# EAGLE design tohuart (EAGLE 7.2.0)
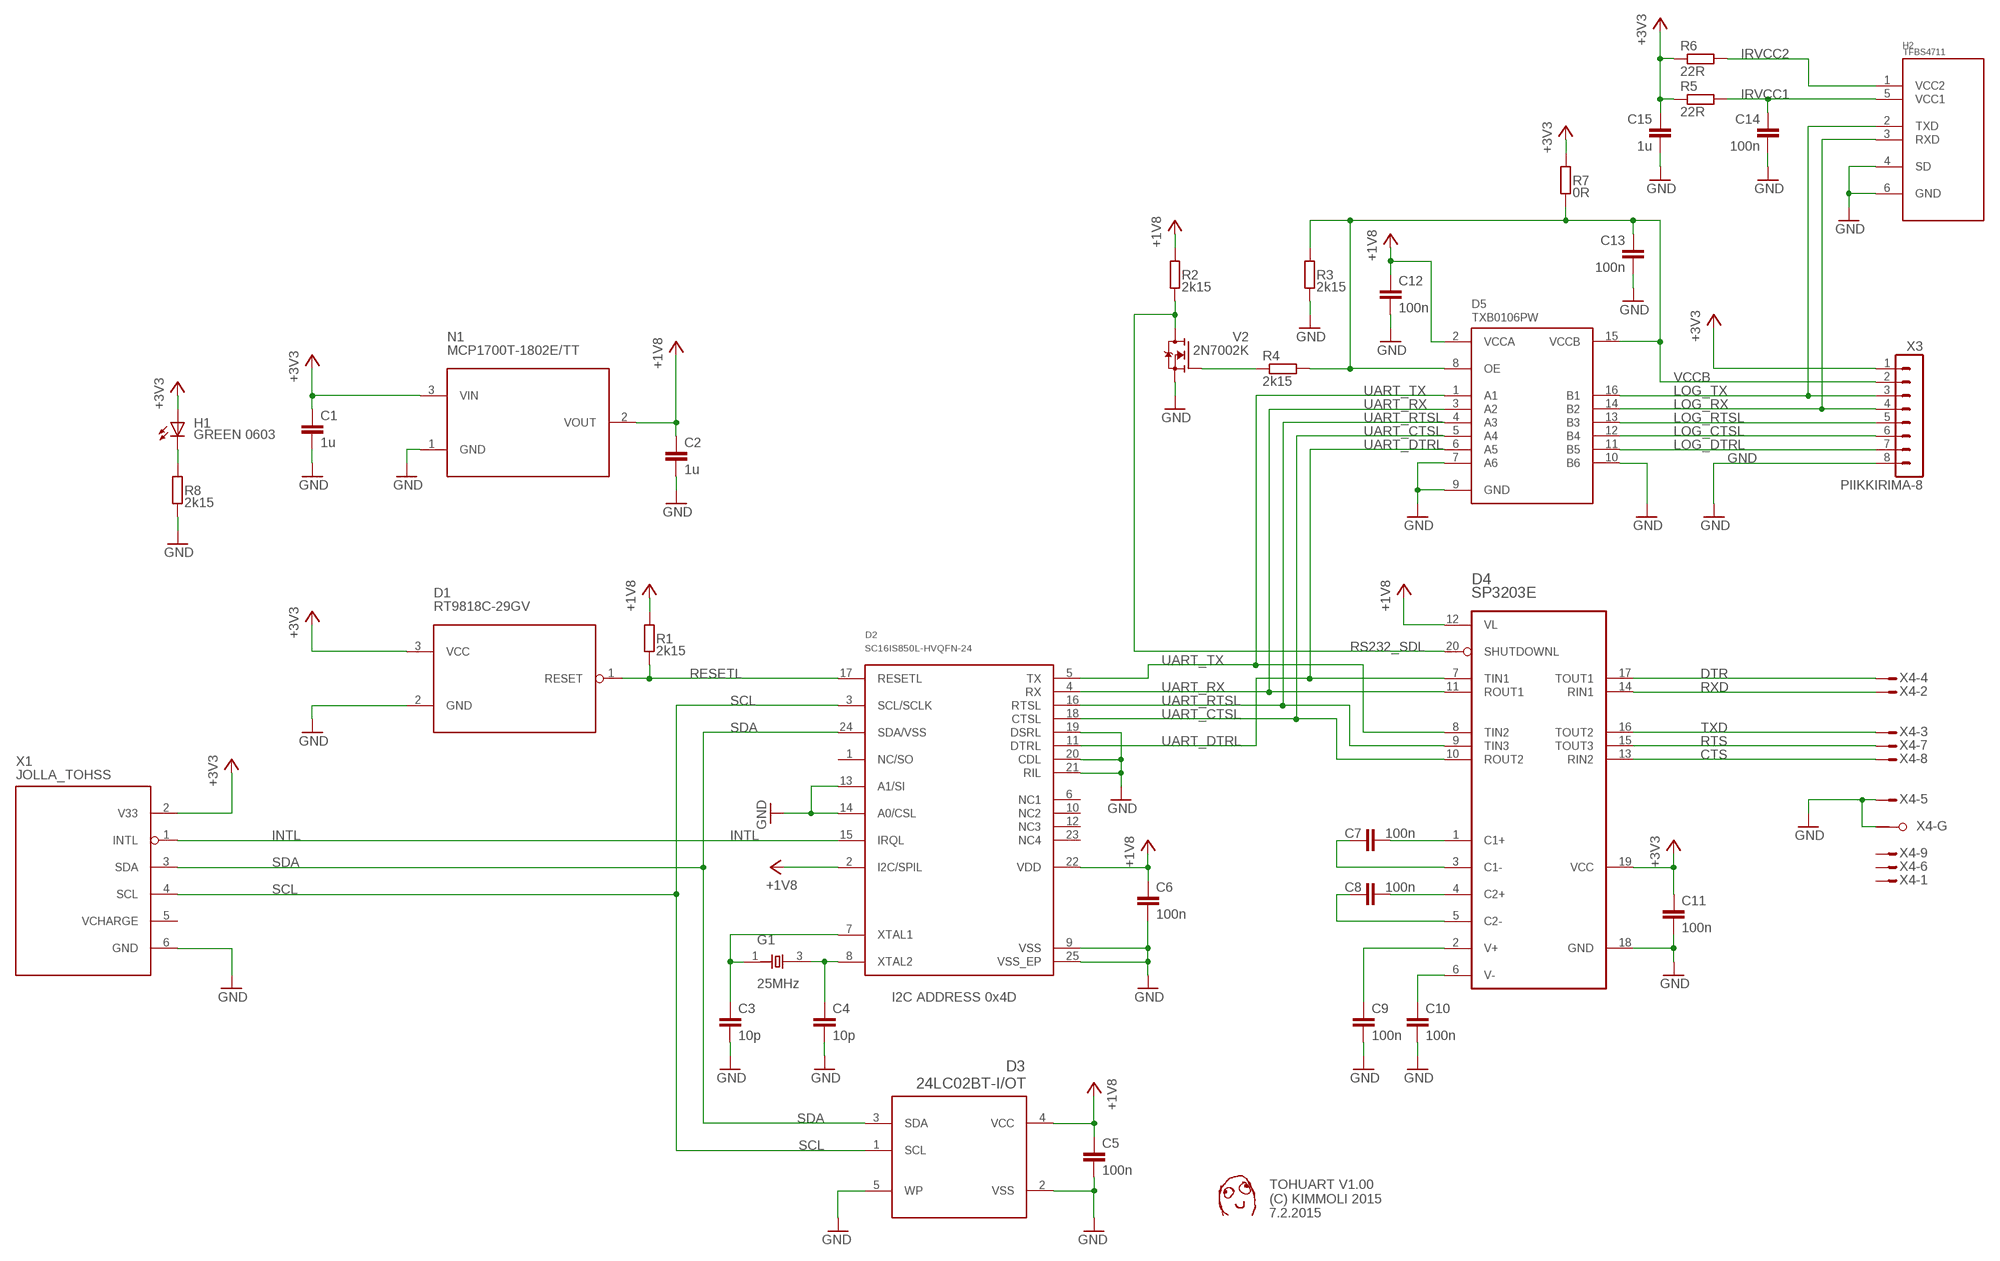
[diagram p0: schematic, sheet 1]

## Parts
C1  1u  C-EUC0603  [C0603]
C2  1u  C-EUC0603  [C0603]
C3  10p  C-EUC0603  [C0603]
C4  10p  C-EUC0603  [C0603]
C5  100n  C-EUC0603  [C0603]
C6  100n  C-EUC0603  [C0603]
C7  100n  C-EUC0603  [C0603]
C8  100n  C-EUC0603  [C0603]
C9  100n  C-EUC0603  [C0603]
C10  100n  C-EUC0603  [C0603]
C11  100n  C-EUC0603  [C0603]
C12  100n  C-EUC0603  [C0603]
C13  100n  C-EUC0603  [C0603]
C14  100n  C-EUC0603  [C0603]
C15  1u  C-EUC0603  [C0603]
D1  RT9818C-29GV  [SOT23]
D2  SC16IS850L-HVQFN-24  [HVQFN-24]
D3  24LC02BT-I/OT  [SOT95P280X145-5N]
D4  SP3203E  [TSSOP-20]
D5  TXB0106PW  [TSSOP-16-065]
G1  25MHz  XTAL_3225_SMD  [X_3225]
H1  GREEN 0603  LEDCHIP-LED0603  [CHIP-LED0603]
H2  TFBS4711  [TFBS4711]
N1  MCP1700T-1802E/TT  [SOT23]
R1  2k15  R-EU_R0603  [R0603]
R2  2k15  R-EU_R0603  [R0603]
R3  2k15  R-EU_R0603  [R0603]
R4  2k15  R-EU_R0603  [R0603]
R5  22R  R-EU_R0603  [R0603]
R6  22R  R-EU_R0603  [R0603]
R7  0R  R-EU_R0603  [R0603]
R8  2k15  R-EU_R0603  [R0603]
U$1  DAFUG  [DAFUG]
V2  2N7002K  [SOT23]
X1  JOLLA_TOHSS  [JOLLA_TOH_POGOPADS]
X3  PIIKKIRIMA-8  [PIIKKIRIMA-8]
X4  M09VPS  [M09VP]

## Nets
+1V8: C2.1 C5.1 C6.1 C12.1 D2.2(I2C/SPIL) D2.22(VDD) D3.4(VCC) D4.12(VL) D5.2(VCCA) N1.2(VOUT) R1.2 R2.2
+3V3: C1.1 C11.1 C15.1 D1.3(VCC) D4.19(VCC) H1.A N1.3(VIN) R5.1 R6.1 R7.2 X1.2(V33) X3.1
CTS: D4.13(RIN2) X4.8(-8:M)
DTR: D4.17(TOUT1) X4.4(-4:M)
GND: C1.2 C2.2 C3.2 C4.2 C5.2 C6.2 C9.2 C10.2 C11.2 C12.2 C13.2 C14.2 C15.2 D1.2(GND) D2.9(VSS) D2.13(A1/SI) D2.14(A0/CSL) D2.19(DSRL) D2.20(CDL) D2.21(RIL) D2.25(VSS_EP) D3.2(VSS) D3.5(WP) D4.18(GND) D5.7(A6) D5.9(GND) D5.10(B6) H2.4(SD) H2.6(GND) N1.1(GND) R3.1 R8.1 V2.2(S) X1.6(GND) X3.8 X4.5(-5:M) X4.G1(-G:G1)
INTL: D2.15(IRQL) X1.1(INTL)
IRVCC1: C14.1 H2.5(VCC1) R5.2
IRVCC2: H2.1(VCC2) R6.2
LOG_CTSL: D5.12(B4) X3.6
LOG_DTRL: D5.11(B5) X3.7
LOG_RTSL: D5.13(B3) X3.5
LOG_RX: D5.14(B2) H2.3(RXD) X3.4
LOG_TX: D5.16(B1) H2.2(TXD) X3.3
N$1: R4.1 V2.1(G)
N$2: H1.C R8.2
N$4: C10.1 D4.6(V-)
N$5: C9.1 D4.2(V+)
N$6: C8.1 D4.5(C2-)
N$7: C8.2 D4.4(C2+)
N$8: C7.1 D4.3(C1-)
N$9: C7.2 D4.1(C1+)
N$14: C4.1 D2.8(XTAL2) G1.3(X2)
N$15: C3.1 D2.7(XTAL1) G1.1(X1)
RESETL: D1.1(RESET) D2.17(RESETL) R1.1
RS232_SDL: D4.20(SHUTDOWNL) R2.1 V2.3(D)
RTS: D4.15(TOUT3) X4.7(-7:M)
RXD: D4.14(RIN1) X4.2(-2:M)
SCL: D2.3(SCL/SCLK) D3.1(SCL) X1.4(SCL)
SDA: D2.24(SDA/VSS) D3.3(SDA) X1.3(SDA)
TXD: D4.16(TOUT2) X4.3(-3:M)
UART_CTSL: D2.18(CTSL) D4.10(ROUT2) D5.5(A4)
UART_DTRL: D2.11(DTRL) D4.7(TIN1) D5.6(A5)
UART_RTSL: D2.16(RTSL) D4.9(TIN3) D5.4(A3)
UART_RX: D2.4(RX) D4.11(ROUT1) D5.3(A2)
UART_TX: D2.5(TX) D4.8(TIN2) D5.1(A1)
VCCB: C13.1 D5.8(OE) D5.15(VCCB) R3.2 R4.2 R7.1 X3.2
Unconnected: D2.1(NC/SO) D2.6(NC1) D2.10(NC2) D2.12(NC3) D2.23(NC4) X1.5(VCHARGE) X4.1(-1:M) X4.6(-6:M) X4.9(-9:M) X4.G2(-G:G2)

## Notes on the sheet
- I2C ADDRESS 0x4D
- TOHUART V1.00
  (C) KIMMOLI 2015
  7.2.2015

## Library data of the parts
C1-C15 = rcl:C-EU: CAPACITOR, European symbol
D1 = OMAT_IC:RT9818C-29GV
D2 = OMAT_IC:SC16IS850L-HVQFN-24
D3 = OMAT_IC:24LC02BT-I/OT: Serial EEPROM; MPN: 24LC02BT-I/OT; OC_FARNELL: 9757910; OC_NEWARK: 89C9800; PACKAGE: SOT23-5; SUPPLIER: MICROCHIP
D4 = OMAT_IC:SP3203E
D5 = OMAT_IC:TXB0106PW
G1 = OMAT_IC:XTAL_3225_SMD: CRYSTAL CLOCK OSCILLATORS 5.0 Vdc or 3.3 Vdc - LOW PROFILE ULTRA MINIATURE CERAMIC SURFACE MOUNT Source: http://www.abracon.com/Oscillators/asf1-L-L1.pdf
H1 = OMAT_IC:LED: LED OSRAM: - CHIPLED LG R971, LG N971, LY N971, LG Q971, LY Q971, LO R971, LY R971 LH N974, LH R974 LS Q976, LO Q976, LY Q976 LO Q996 - Hyper CHIPLED LW Q18S LB Q993, LB Q99A, LB R99A - SideLED LS A670, LO A670, LY A670, LG A670, LP A670 LB A673, LV A673, LT A673, LW A673 LH A674 LY A675 LS A676, LA A676, LO A676, LY A676, LW A676 LS A679, LY A679, LG A679 - Hyper Micro SIDELED® LS Y876, LA Y876, LO Y876, LY Y876 LT Y87S - SmartLED LW L88C, LW L88S LB L89C, LB L89S, LG L890 LS L89K, LO L89K, LY L89K LS L896, LA L896, LO L896, LY L896 - TOPLED LS T670, LO T670, LY T670, LG T670, LP T670 LSG T670, LSP T670, LSY T670, LOP T670, LYG T670 LG T671, LOG T671, LSG T671 LB T673, LV T673, LT T673, LW T673 LH T674 LS T676, LA T676, LO T676, LY T676, LB T676, LH T676, LSB T676, LW T676 LB T67C, LV T67C, LT T67C, LS T67K, LO T67K, LY T67K, LW E67C LS E67B, LA E67B, LO E67B, LY E67B, LB E67C, LV E67C, LT E67C LW T67C LS T679, LY T679, LG T679 LS T770, LO T770, LY T770, LG T770, LP T770 LB T773, LV T773, LT T773, LW T773 LH T774 LS E675, LA E675, LY E675, LS T675 LS T776, LA T776, LO T776, LY T776, LB T776 LHGB T686 LT T68C, LB T68C - Hyper Mini TOPLED® LB M676 - Mini TOPLED Santana® LG M470 LS M47K, LO M47K, LY M47K Source: http://www.osram.convergy.de LUXEON: - LUMILED® LXK2-PW12-R00, LXK2-PW12-S00, LXK2-PW14-U00, LXK2-PW14-V00 LXK2-PM12-R00, LXK2-PM12-S00, LXK2-PM14-U00 LXK2-PE12-Q00, LXK2-PE12-R00, LXK2-PE12-S00, LXK2-PE14-T00, LXK2-PE14-U00 LXK2-PB12-K00, LXK2-PB12-L00, LXK2-PB12-M00, LXK2-PB14-N00, LXK2-PB14-P00, LXK2-PB14-Q00 LXK2-PR12-L00, LXK2-PR12-M00, LXK2-PR14-Q00, LXK2-PR14-R00 LXK2-PD12-Q00, LXK2-PD12-R00, LXK2-PD12-S00 LXK2-PH12-R00, LXK2-PH12-S00 LXK2-PL12-P00, LXK2-PL12-Q00, LXK2-PL12-R00 Source: www.luxeon.com KINGBRIGHT: KA-3528ASYC Source: www.kingbright.com
H2 = OMAT_IC:TFBS4711
N1 = OMAT_IC:MCP1700T-1802E/TT
R1-R8 = rcl:R-EU_: RESISTOR, European symbol
U$1 = dafug:DAFUG
V2 = OMAT_IC:2N7002K
X1 = jollatoh:JOLLA_TOH
X3 = OMAT_IC:PIIKKIRIMA-8
X4 = con-subd:M09VPS: SUB-D; OC_FARNELL: unknown; OC_NEWARK: unknown

## Board
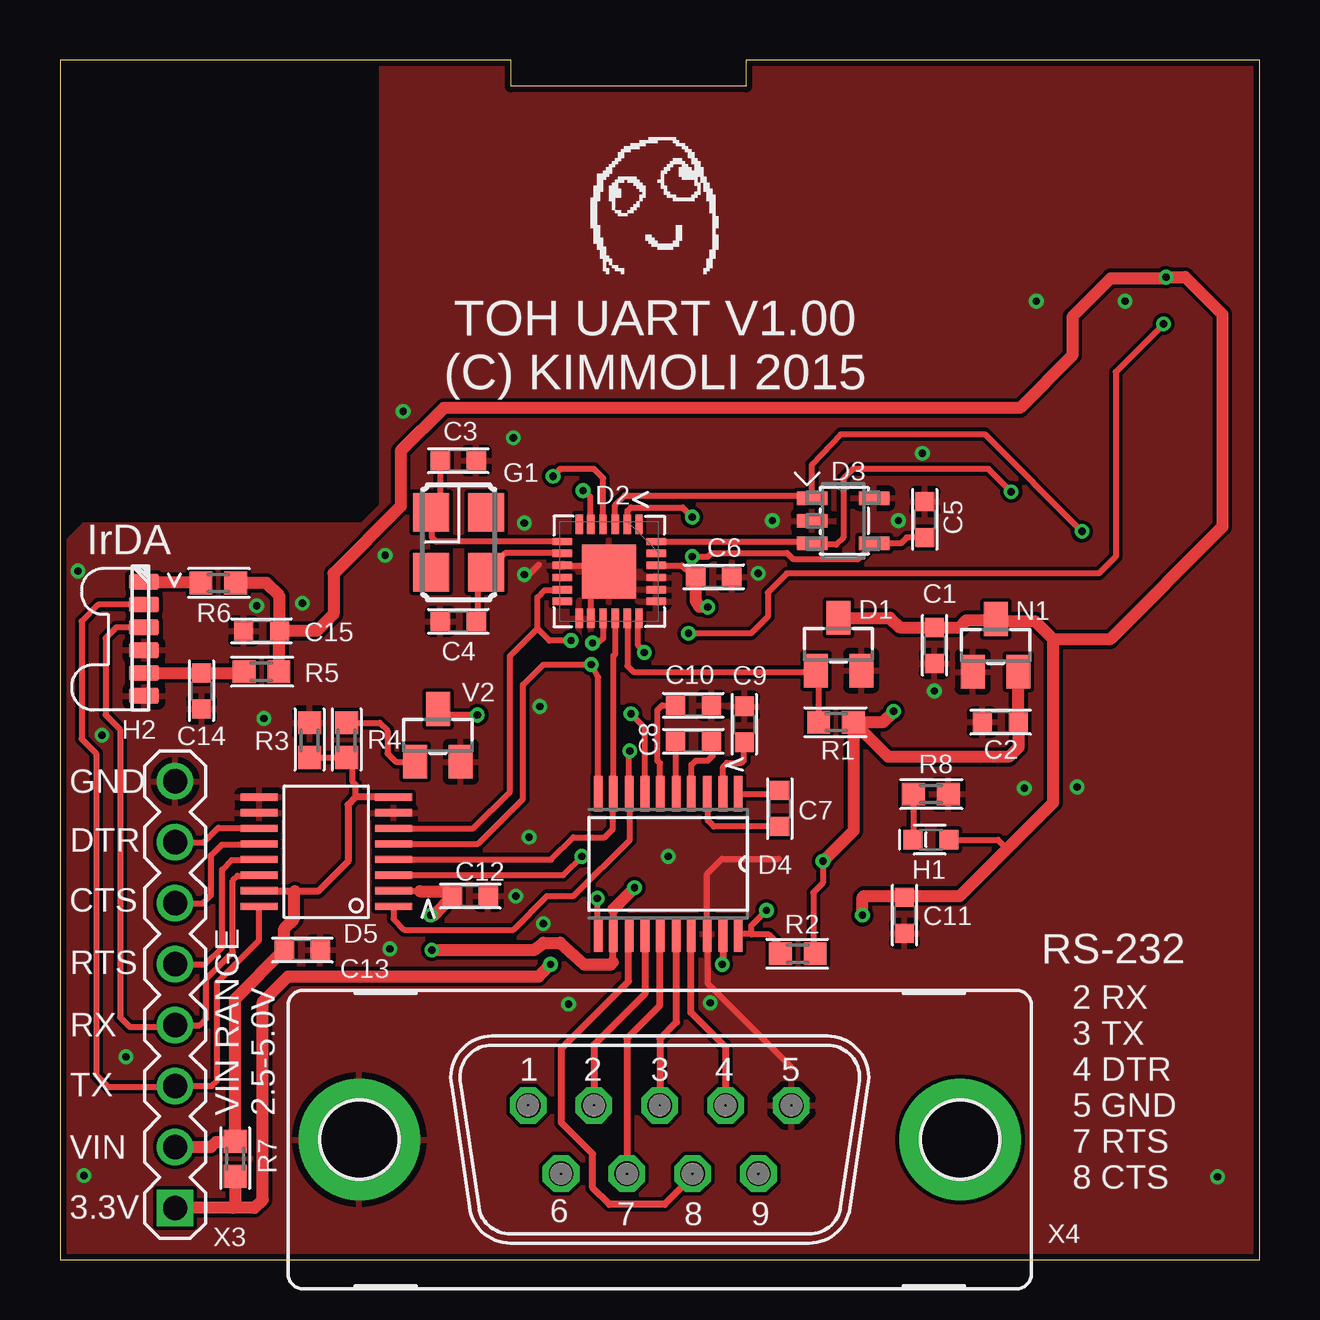
[diagram p1: board, top side]
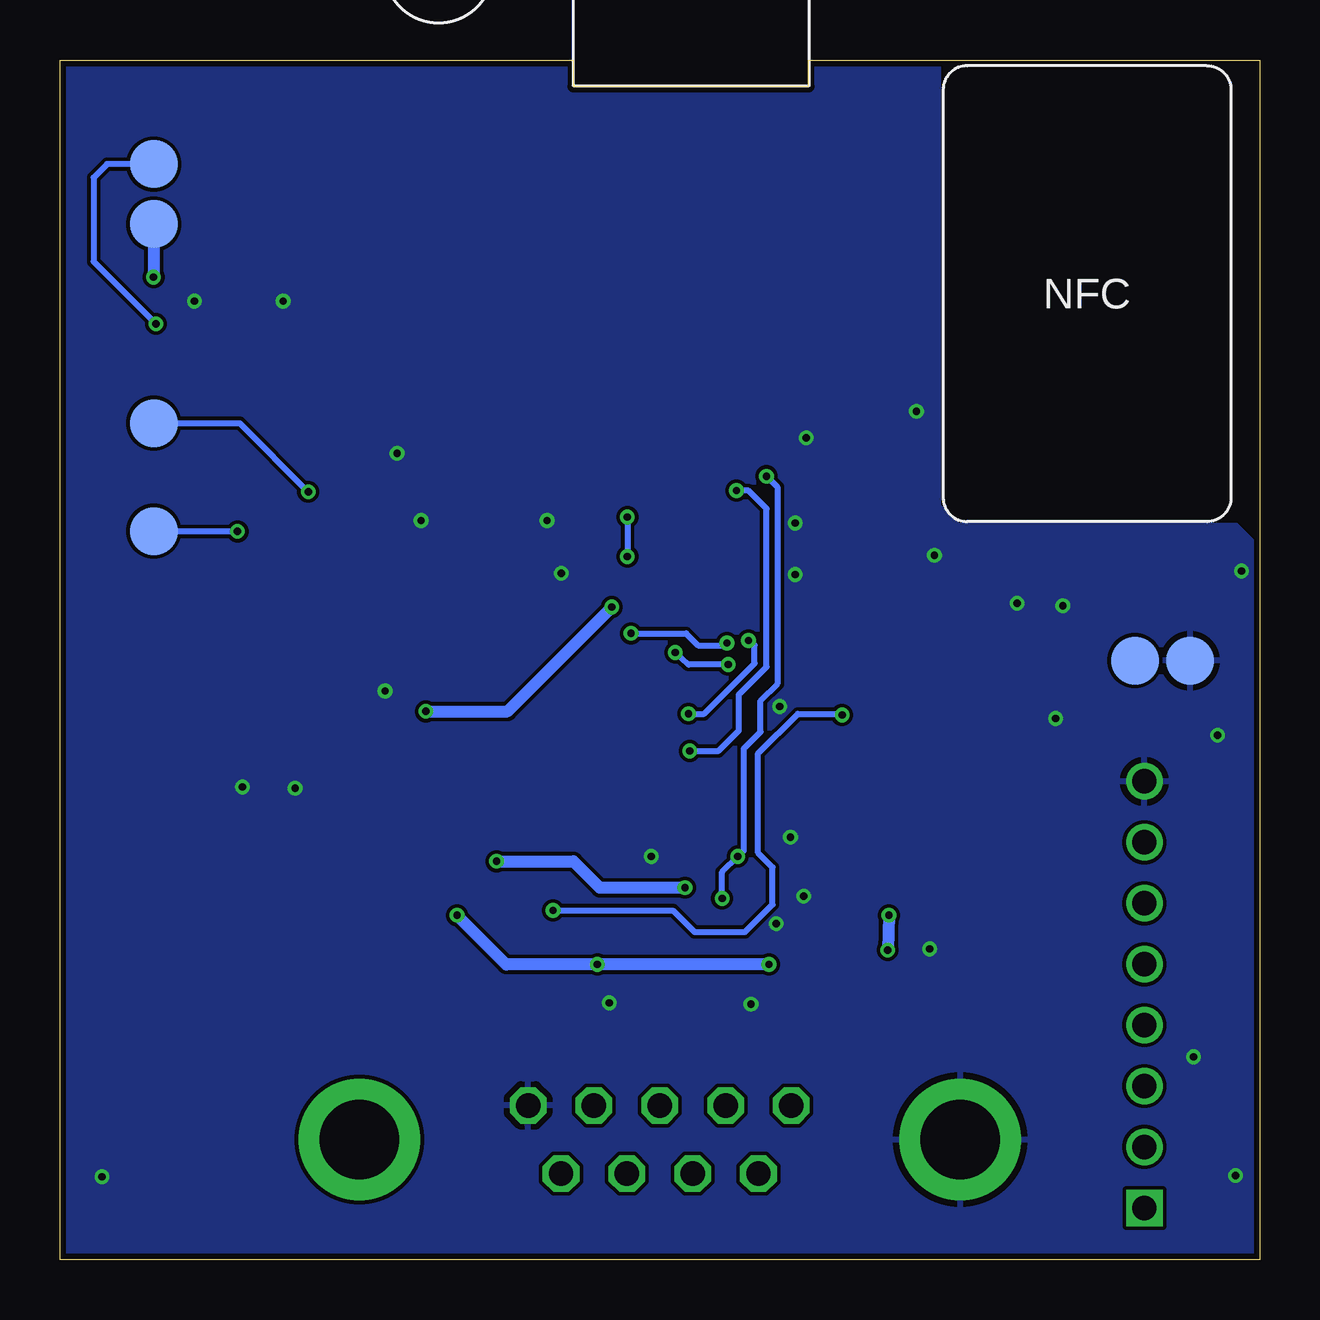
[diagram p2: board, bottom side, seen from below]

Size 50 x 50 mm. Coordinates in mm from the lower left corner, seen from the top.
Outline: 0,0 50,0 50,50 28.6,50 28.6,48.9 18.8,48.9 18.8,50 0,50 0,0
Copper layers (1*16): Top 0.035mm / dielectric 1.5mm / Bottom 0.035mm
Design rules "ITEADstudio_DRC": minimum track width 6mil, minimum drill 12mil, track to track 6mil, track to pad 6mil, pad to pad 6mil, via to via 6mil, smd to smd 0mil, copper to edge 10mil, drill to drill 10mil, minimum pad ring 10mil, minimum via ring 6mil, stop-mask expansion 2mil, vias tented up to drill 100mil, thermal gap 10mil

### Footprints (pad centres in the part's own frame; a part is rotated, then mirrored left to right if it is on the bottom)
C0603 = smd 0.8 x 0.8: 1 -0.75,0; 2 0.75,0
SOT23 = smd 1 x 1.4: 1 -0.95,-1.1; 2 0.95,-1.1; 3 0,1.1
HVQFN-24 = smd 0.813 x 0.305: 1 -1.956,1.245; 2 -1.956,0.762; 3 -1.956,0.254; 4 -1.956,-0.254; 5 -1.956,-0.762; 6 -1.956,-1.245; 13 1.956,-1.245; 14 1.956,-0.762; 15 1.956,-0.254; 16 1.956,0.254; 17 1.956,0.762; 18 1.956,1.245 | smd 0.305 x 0.813: 7 -1.245,-1.956; 8 -0.762,-1.956; 9 -0.254,-1.956; 10 0.254,-1.956; 11 0.762,-1.956; 12 1.245,-1.956; 19 1.245,1.956; 20 0.762,1.956; 21 0.254,1.956; 22 -0.254,1.956; 23 -0.762,1.956; 24 -1.245,1.956 | smd 2.261 x 2.261: 25 0,0
SOT95P280X145-5N = smd 1.27 x 0.559: 1 -1.295,0.94; 2 -1.295,0; 3 -1.295,-0.94; 4 1.295,-0.94; 5 1.295,0.94
TSSOP-20 = smd 1.473 x 0.356: 1 -3.201,2.881; 2 -3.201,2.246; 3 -3.201,1.586; 4 -3.201,0.925; 5 -3.201,0.29; 6 -3.201,-0.37; 7 -3.201,-1.005; 8 -3.201,-1.666; 9 -3.201,-2.326; 10 -3.201,-2.961; 11 2.641,-2.961; 12 2.641,-2.326; 13 2.641,-1.666; 14 2.641,-1.005; 15 2.641,-0.37; 16 2.641,0.29; 17 2.641,0.925; 18 2.641,1.586; 19 2.641,2.246; 20 2.641,2.881
TSSOP-16-065 = smd 1.55 x 0.3: 1 -2.8,2.275; 2 -2.8,1.625; 3 -2.8,0.975; 4 -2.8,0.325; 5 -2.8,-0.325; 6 -2.8,-0.975; 7 -2.8,-1.625; 8 -2.8,-2.275; 9 2.8,-2.275; 10 2.8,-1.625; 11 2.8,-0.975; 12 2.8,-0.325; 13 2.8,0.325; 14 2.8,0.975; 15 2.8,1.625; 16 2.8,2.275
X_3225 = smd 1.6 x 1.5: 1 -1.25,-1.15; 2 1.25,-1.15; 3 1.25,1.15; 4 -1.25,1.15
CHIP-LED0603 = smd 0.8 x 0.8: A -0.75,0; C 0.75,0
TFBS4711 = smd 0.64 x 1.27: 1 4.75,0; 2 3.8,0; 3 2.85,0; 4 1.9,0; 5 0.95,0; 6 0,0
R0603 = smd 0.95 x 0.95: 1 -0.725,0; 2 0.725,0
JOLLA_TOH_POGOPADS = smd 2 x 2 bottom: 1 43.2,20.7; 2 43.2,18.2; 3 43.2,9.9; 4 43.2,5.4; 5 2.3,0; 6 0,0
PIIKKIRIMA-8 = drill 1.016 square: 1 0,0 | drill 1.016: 2 2.54,0; 3 5.08,0; 4 7.62,0; 5 10.16,0; 6 12.7,0; 7 15.24,0; 8 17.78,0
M09VP = drill 1.016 octagon: 1 -5.486,1.422; 2 -2.743,1.422; 3 0,1.422; 4 2.743,1.422; 5 5.486,1.422; 6 -4.115,-1.422; 7 -1.372,-1.422; 8 1.372,-1.422; 9 4.115,-1.422 | drill 3.302 pad 5.08: G1 -12.522,0; G2 12.522,0

### Placement (x,y rotation side)
C1  36.45,25.6 270 top
C2  39.2,22.4 180 top
C3  16.6,33.3 0 top
C4  16.6,26.6 180 top
C5  36.05,30.85 90 top
C6  27.25,28.45 0 top
C7  30,18.8 90 top
C8  26.4,21.6 0 top
C9  28.53,22.31 90 top
C10  26.4,23.1 0 top
C11  35.2,14.35 270 top
C12  17.1,15.15 0 top
C13  10.1,12.9 0 top
C14  5.9,23.7 270 top
C15  8.4,26.2 180 top
D1  32.45,25.65 0 top
D2  22.89,28.68 270 top
D3  32.64,30.79 0 top
D4  25.39,16.21 270 top
D5  11.1,17 180 top
G1  16.62,29.9 270 top
H1  36.3,17.5 180 top
H2  3.5,23.5 90 top
N1  39,25.6 0 top
R1  32.35,22.4 0 top
R2  30.75,12.75 0 top
R3  10.4,21.65 270 top
R4  11.95,21.65 270 top
R5  8.4,24.5 180 top
R6  6.6,28.2 180 top
R7  7.3,4.2 270 top
R8  36.3,19.4 180 top
U$1  24.98,43.68 0 top
V2  15.75,21.85 0 top
X1  2.89,24.96 0 top
X3  4.8,2.15 90 top
X4  25,5 0 top

### Tracks (layer width: path | path; a pad name or v marks a point on that pad's centre or on a via)
+1V8  (via drill 0.3)
  Top 0.25: C5.1 35.3,30.1 35.05,29.85 D3.4 33.28,29.2 30.55,29.2 30.3,29.45 27.15,29.45 27,29.3 v26.35,29.3 26.35,29.05 26.05,28.8 | D2.22 25.92,28.93 26.05,28.8 | 26.05,28.8 C6.1 | D2.2 23.65,31.2 23.8,31.35 25.95,31.35 v26.35,30.95 | v31.8,16.6 31.8,15.7 31.4,15.3 31.4,12.82 R2.2 | D5.2 14.97,15.38 15,15.35
  Top 0.3: 23.06,14.61 D4.12 23.05,13.55 23.05,12.4
  Top 0.5: 23.06,14.61 v23.95,15.5 | R1.2 33.08,17.88 v31.8,16.6 | R1.2 34.52,20.95 39.55,20.95 39.95,21.35 C2.1 N1.2 | R1.2 34.3,22.4 v34.75,22.85 | v27,27.2 26.65,27.2 26.5,27.45 C6.1 | v15.45,14.35 15.6,14.35 C12.1 16.15,15.35 15,15.35 | v15.5,12.9 19.75,12.9 20.15,13.2 20.85,13.2 21.85,12.3 22.95,12.3 23.05,12.4
  Bottom 0.25: v26.35,30.95 v26.35,29.3
  Bottom 0.5: v23.95,15.5 27.5,15.5 28.6,16.6 v31.8,16.6 | v34.75,22.85 31.35,22.85 v27,27.2 | v15.45,14.35 v15.5,12.9
+3V3  (via drill 0.3)
  Top 0.25: H1.A 39.1,17.5 39.48,17.12
  Top 0.3: D4.19 27.64,12.34
  Top 0.5: 39.05,26.65 37.8,26.65 37.5,26.35 C1.1 35,26.35 34.6,26.75 D1.3 | 39.05,26.65 39.19,26.65 39.24,26.6 40.65,26.6 41.4,25.85 | 35.2,15.15 33.5,15.15 33.45,15.1 v33.45,14.35 | 35.2,15.15 37.5,15.15 39.48,17.12 41.4,19.05 41.4,25.85 | 41.4,25.85 43.75,25.85 48.45,30.55 48.45,39.4 46.9,40.95 v46.1,40.95 46.05,40.9 43.8,40.9 42.2,39.3 42.2,37.7 40,35.5 16,35.5 14.2,33.7 14.2,31.4 11.4,28.6 11.4,26.9 10.7,26.2 C15.1 | N1.3 39.05,26.65 | v20.45,12.3 19.95,11.8 9.5,11.8 8.45,10.75 8.45,2.5 8.1,2.15 7.2,2.15 | C11.1 35.2,15.15 | 27.64,12.34 v27.6,12.3 | 7.2,2.15 X3.1 | R7.2 7.3,2.25 7.2,2.15 | R5.1 9.12,26.18 C15.1 | C15.1 9.15,27.65 8.6,28.2 R6.1
  Bottom 0.5: X1.2 v46.09,40.96 v46.1,40.95 | v20.45,12.3 v27.6,12.3 31.4,12.3 v33.45,14.35
CTS
  Top 0.25: 23.7,13.54 D4.13
  Top 0.3: 23.7,13.54 23.7,11.6 20.9,8.8 20.9,5.7 22.2,4.4 22.2,3 22.9,2.3 25.2,2.3 26.37,3.47 X4.8
DTR
  Top 0.25: 26.3,13.55 D4.17
  Top 0.3: 26.3,13.55 26.3,10.3 27.74,8.86 X4.4
GND  (via drill 0.3)
  Top 0.25: 29.95,16.7 27.6,16.7 26.98,16.08 D4.18 27,13.54 27,11.5 30.49,8.01 | v19.35,28.55 19.55,28.55 19.95,28.95 | D2.9 22.15,28.93 | 22.15,28.93 22.64,28.93 D2.25 | D2.14 22.13,28.91 22.15,28.93
  other vias: 29.7,30.8 29.1,28.6 36.45,23.7 1.75,21.85 0.75,28.7 13.55,29.35 8.5,22.55 34.95,30.8 21.2,10.65 27.1,10.7 25.35,16.8 40.2,19.65 42.4,19.7 19.35,30.7 19.55,17.6 19,15.15 1,3.5 48.25,3.45 20,23.05 20.15,14 44.4,39.95 35.95,33.6 13.75,12.95 40.7,39.95 18.9,34.25 14.3,35.35 10.1,27.35 8.2,27.25 2.75,8.45
  pour Top: 0,0 50,0 50,50 28.6,50 28.6,48.9 18.8,48.9 18.8,50 13.4,50 13.4,31.4 12.6,30.6 1,30.6 0,29.6
  pour Bottom: 0,0 50,0 50,50 29,50 28.6,50 28.6,48.9 18.8,48.9 18.8,50 13.4,50 13.4,31.4 12.6,30.6 1,30.6 0,29.6
INTL  (via drill 0.3)
  Top 0.25: v46,39 44,37 44,29.3 43.3,28.6 30.3,28.6 29.5,27.8 29.5,26.8 28.8,26.1 v26.2,26.1 | v22.2,25.7 22.4,25.7 22.65,25.9 22.65,26.69 D2.15
  Bottom 0.25: X1.1 48.04,45.66 48.6,45.1 48.6,41.6 v46,39 | v26.2,26.1 23.9,26.1 23.4,25.6 22.3,25.6 v22.2,25.7
IRVCC1
  Top 0.5: H2.5 C14.1 7.62,24.45 R5.2
IRVCC2
  Top 0.5: H2.1 5.83,28.25 R6.2
LOG_CTSL
  Top 0.25: X3.6 5.95,14.85 6.3,15.2 6.3,16.85 6.75,17.3 8.28,17.3 D5.12
LOG_DTRL
  Top 0.25: X3.7 5.99,17.39 6.6,18 8.28,18 D5.11
LOG_RTSL
  Top 0.25: X3.5 6.06,12.31 6.75,13 6.75,16.25 7.15,16.65 8.28,16.65 D5.13
LOG_RX
  Top 0.25: D5.14 8.28,16 7.4,16 7.2,15.8 7.2,12.8 6.1,11.7 6.1,10.05 5.82,9.77 X3.4 4.73,9.7 2.9,9.7 2.5,10.1 2.5,22.1 1.9,22.7 1.9,25.9 2.35,26.35 H2.3
LOG_TX
  Top 0.25: D5.16 8.3,13.3 6.55,11.55 6.55,7.45 6.33,7.23 X3.3 4.77,7.2 2,7.2 1.5,7.7 1.5,21.1 0.9,21.7 0.9,26.6 1.6,27.3 H2.2
N$1
  Top 0.25: R4.1 13.32,22.38 13.65,22.05 13.65,21.1 14,20.75 V2.1
N$2
  Top 0.25: R8.2 35.58,17.52 H1.C
N$4
  Top 0.25: D4.6 25.02,20.68 24.9,20.8 24.9,22.9 25.1,23.1 C10.1
N$5
  Top 0.25: D4.2 27.64,20.54 27.8,20.7 28.4,20.7 28.5,20.8 28.5,21.53 C9.1
N$6
  Top 0.25: D4.5 25.68,21.57 C8.1
N$7
  Top 0.25: D4.4 26.32,20.61 26.5,20.8 27,20.8 27.2,21 27.2,21.55 C8.2
N$8
  Top 0.25: C7.1 27.25,18.05 27,18.3 27,19.39 D4.3
N$9
  Top 0.25: D4.1 29.86,19.41 C7.2
N$14
  Top 0.25: D2.8 18.56,29.44 G1.3 17.77,28.47 17.4,28.1 17.4,26.65 C4.1
N$15
  Top 0.25: D2.7 15.68,29.93 15.5,30.1 15.5,31.12 G1.1 | 15.37,31.25 G1.1 | C3.1 15.85,31.53 G1.1
RESETL
  Top 0.25: D2.17 23.65,24.75 23.9,24.5 31.45,24.5 D1.1 31.62,24.43 R1.1
RS232_SDL  (via drill 0.3)
  Top 0.25: R2.1 30.02,13.07 29.55,13.55 28.84,13.55 28.82,13.57 | 28.29,13.55 D4.20 28.82,13.57 | 28.82,13.57 28.82,13.92 v29.45,14.55 | v17.4,22.7 16,22.7 V2.3
  Bottom 0.25: v29.45,14.55 24.45,14.55 23.55,13.65 21.45,13.65 20.3,14.8 20.3,16.35 20.9,16.95 20.9,21.1 19.25,22.75 17.45,22.75 v17.4,22.7
RTS
  Top 0.25: 25,13.55 D4.15
  Top 0.3: 25,13.55 25,10.6 23.63,9.23 X4.7
RXD
  Top 0.25: 24.4,13.55 D4.14
  Top 0.3: 24.4,13.55 24.4,11.1 22.26,8.96 X4.2
SCL  (via drill 0.3)
  Top 0.25: D2.3 23.14,31.44 23.55,31.85 31.42,31.85 D3.1 31.34,33.15 32.55,34.4 38.55,34.4 v42.6,30.35
  Bottom 0.25: v42.6,30.35 X1.4
SDA  (via drill 0.3)
  Top 0.25: D2.24 31.27,29.93 D3.3 31.39,29.8 32.35,29.8 32.65,30.1 32.65,32.55 33.05,32.95 38.7,32.95 v39.65,32
  Bottom 0.25: X1.3 42.51,34.86 v39.65,32
TXD
  Top 0.25: 25.7,13.55 D4.16
  Top 0.3: 25.7,13.55 25.7,9.9 25,9.2 X4.3
UART_CTSL  (via drill 0.3)
  Top 0.25: D4.10 22.43,24.27 v22.15,24.8 20.15,24.8 19.3,23.95 19.3,19.2 17.43,17.32 D5.5 | v24.35,25.3 24.35,25.35 24.1,25.6 24.1,26.69 D2.18
  Bottom 0.25: v22.15,24.8 23.8,24.8 v24.35,25.3
UART_DTRL  (via drill 0.3)
  Top 0.25: D4.7 24.39,22.16 v23.8,22.75 | v21.3,25.8 20.4,25.8 19.9,26.3 | 19.9,26.3 19.9,27.6 20.2,27.9 20.92,27.9 D2.11 | D5.6 17.23,17.98 18.75,19.5 18.75,25.15 19.9,26.3
  Bottom 0.25: v23.8,22.75 23.15,22.75 21.05,24.85 21.05,25.6 v21.3,25.8
UART_RTSL
  Top 0.25: D2.16 23.15,25.25 23.06,25.16 D4.9 23.05,19.4 23.05,17.95 22.7,17.6 21.4,17.6 20.48,16.68 D5.4
UART_RX  (via drill 0.3)
  Top 0.25: D2.4 22.64,32.56 22.25,32.95 20.85,32.95 v20.55,32.65 | D4.11 22.4,13.6 v22.4,15.05 | D5.3 20.98,16.02 v21.75,16.8
  Bottom 0.25: v20.55,32.65 20.1,32.2 20.1,24 20.8,23.3 20.8,22 21.5,21.3 21.5,17.05 v21.75,16.8 22.4,16.15 v22.4,15.05
UART_TX  (via drill 0.3)
  Top 0.25: v23.75,21.2 23.72,21.17 D4.8 23.75,19.39 23.75,17.5 21.4,15.15 20.3,15.15 18.9,13.75 14.35,13.75 13.9,14.2 D5.1 | v21.8,32.05 21.85,32.05 22.1,31.8 22.1,30.66 D2.5
  Bottom 0.25: v23.75,21.2 22.55,21.2 21.7,22.05 21.7,23.55 20.55,24.7 20.55,31.3 21.3,32.05 v21.8,32.05
VCCB
  Top 0.25: 12.32,19.27 12.32,19.77 12.2,19.9 12.2,20.88 R4.2 R3.2
  Top 0.3: D5.8 12.32,19.27 12,18.95 12,16.6 10.75,15.35 9.8,15.35 8.32,15.35 D5.15
  Top 0.5: X3.2 6.29,4.69 6.5,4.9 7.28,4.9 R7.1 7.3,10.85 C13.1 9.35,13.8 9.75,14.2 9.75,15.3 9.8,15.35

### Text on the board
tPlace: TOH UART V1.00 / (C) KIMMOLI 2015 | IrDA | GND | DTR | CTS | RTS | RS-232 | RX | TX | VIN RANGE / 2.5-5.0V | VIN | 2 RX / 3 TX / 4 DTR / 5 GND / 7 RTS / 8 CTS | 3.3V